# EasyEDA Pro project 21届智能车+蚂蚁搬家+主驱一体PCB文件.epro, board PCB8
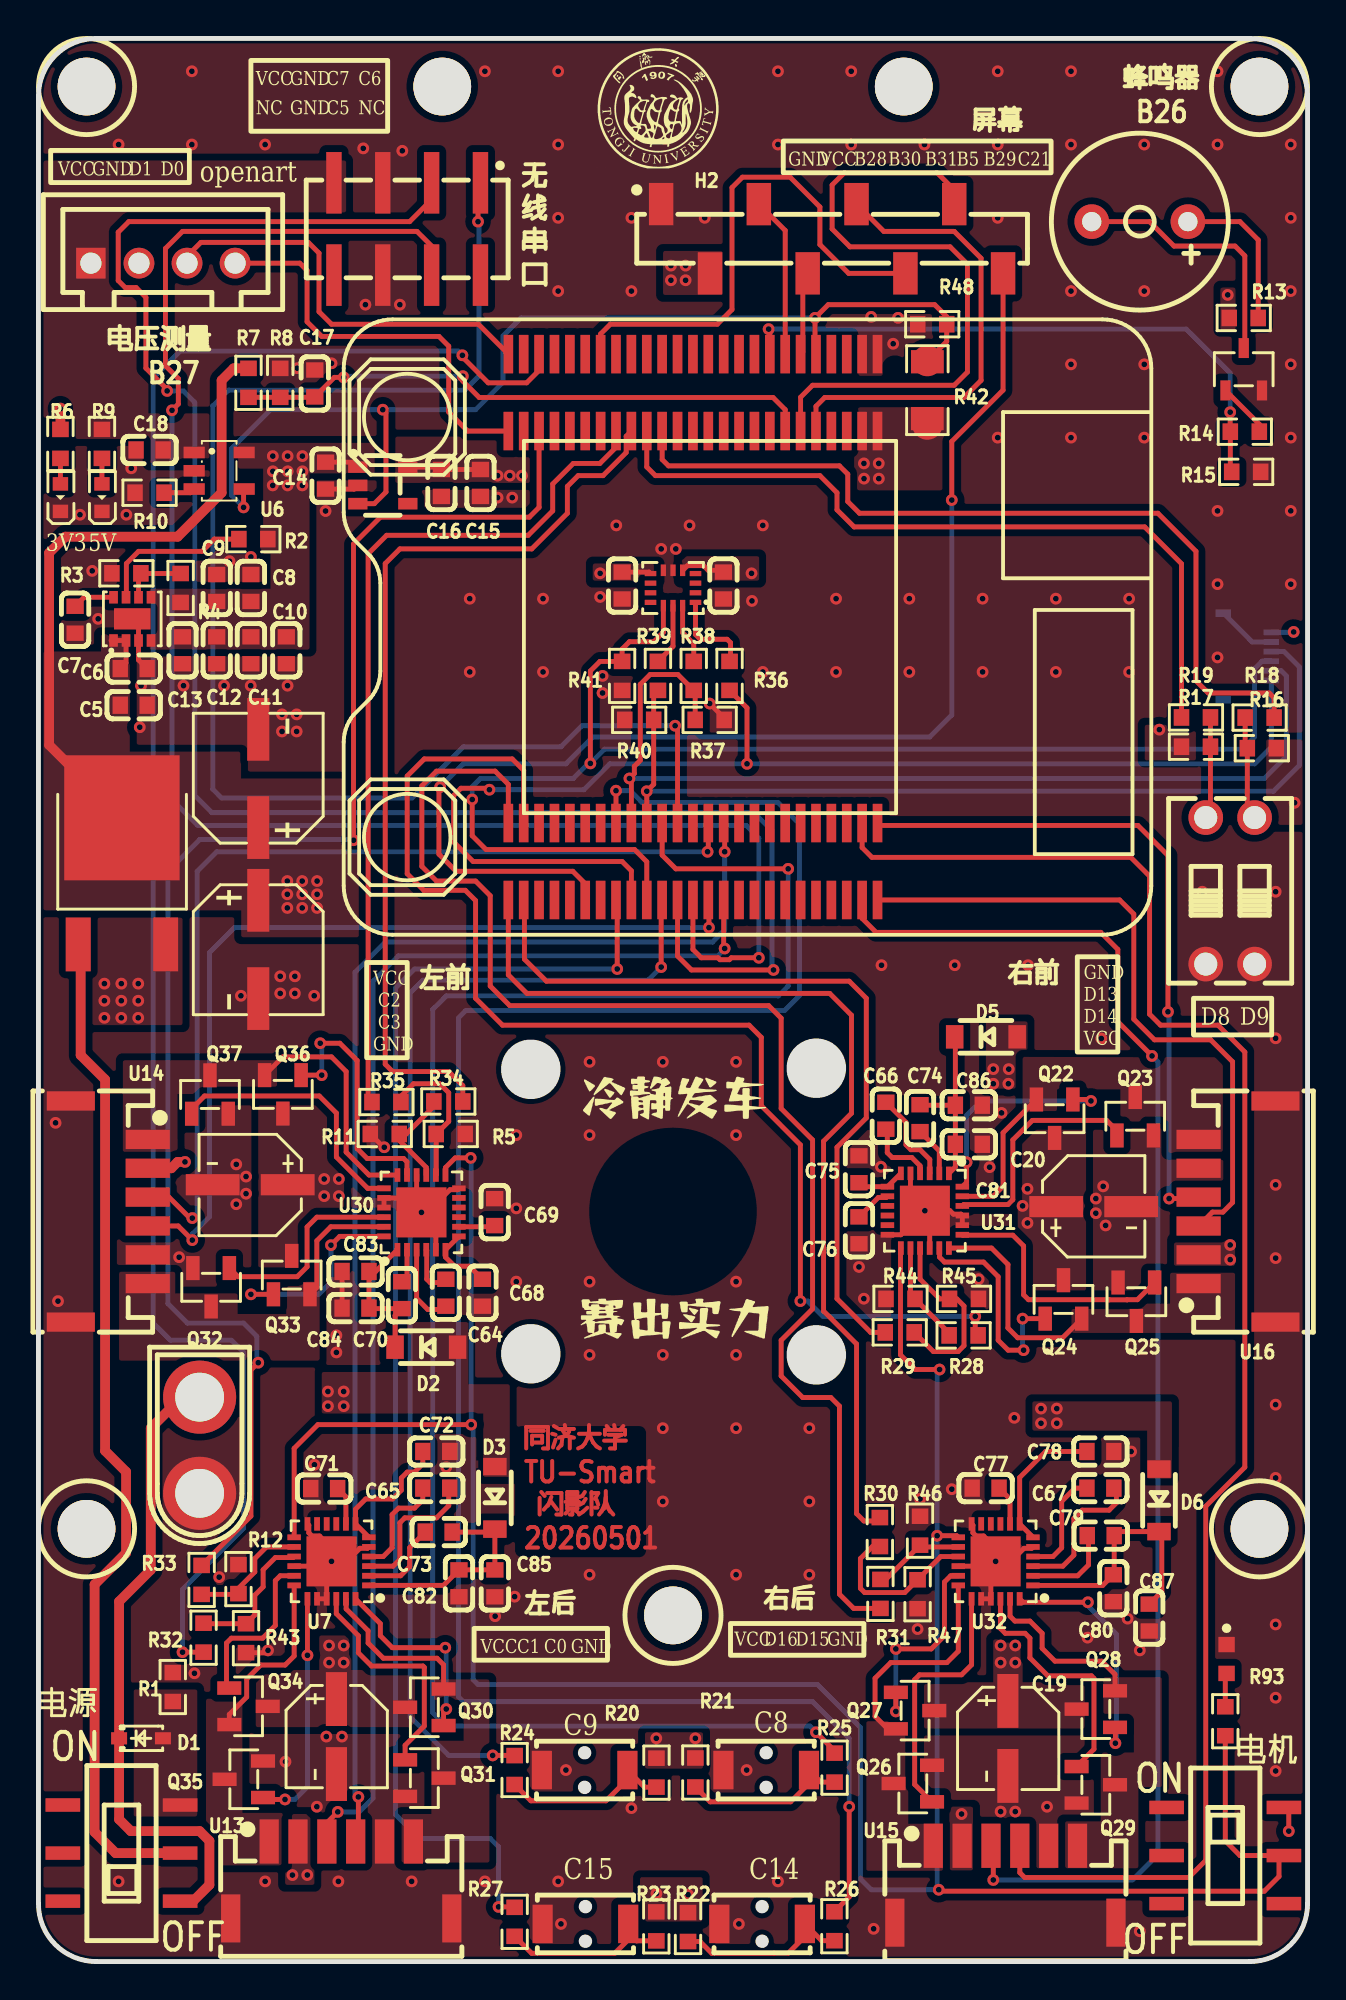
[diagram p39: board, top side]
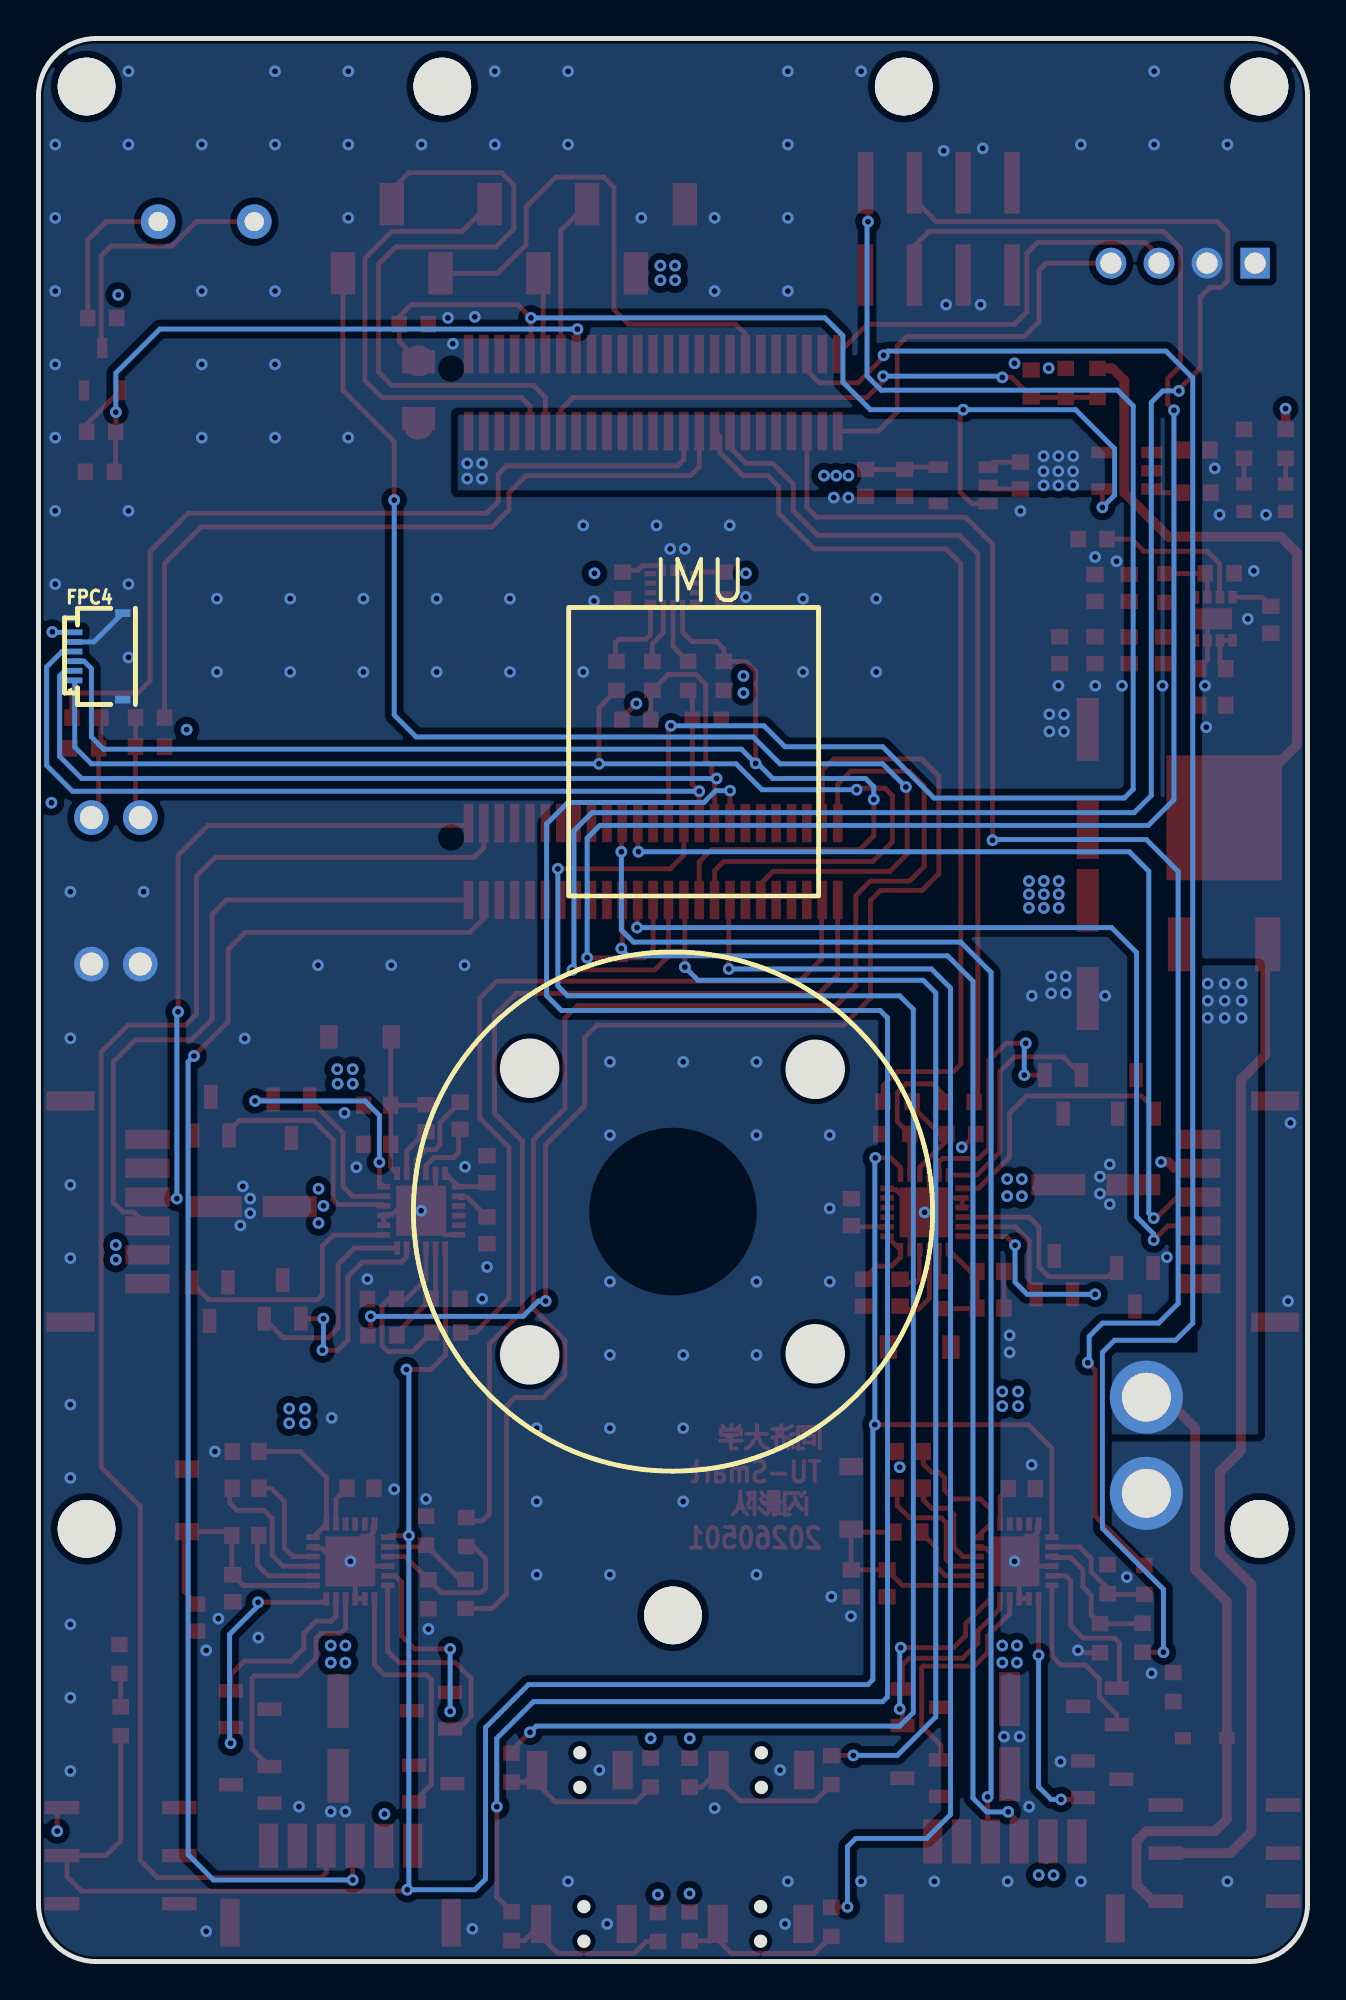
[diagram p40: board, bottom side, seen from below]

Outline 66 x 100 mm; copper layers: Top Layer, GND, POWER, Bottom Layer. Coordinates in mm from the lower left corner of the outline.
Outline path: 0,97 0,3 arc(0.88,0.88) 3,0 63,0 arc(65.12,0.88) 66,3 66,97 arc(65.12,99.12) 63,100 3,100 arc(0.88,99.12) 0,97
Stack: Top Layer 0.035mm 外层铜厚1oz / Dielectric1 0.2104mm 7628 RC49% 8.6mil / GND 0.0152mm 内层铜厚 / Dielectric2 1.065mm 1.1mm H/HOZ Copper / POWER 0.0152mm 内层铜厚 / Dielectric3 0.2104mm 7628 RC49% 8.6mil / Bottom Layer 0.035mm 外层铜厚1oz

## Design rules (mm)
spacing copperThickness1oz (default): track to track 0.152, other pairs 0.152 to 0.356
spacing copperThickness2oz: track to track 0.203, other pairs 0.152 to 0.3
spacing Plane_innerPlane: track to track 0.152, other pairs 0.152 to 0.356
spacing Copper_copperRegion: track to track 0.152, other pairs 0.152 to 0.356
spacing Copper_copperRegion1: track to track 0.152, other pairs 0.152 to 0.356
track width copperThickness1oz (default): min 0.127, default 0.254, max 2.54
track width copperThickness2oz: min 0.203, default 0.254, max 2.54
differential pair differentialPair (default): width min 0.127, default 0.254, max 2.54; gap min 0.152, default 0.152
net VCCBAT uses copperRegion1_copperThickness1oz
net GND uses copperRegion1_copperThickness1oz
net VCC5V uses copperRegion1_copperThickness1oz
net VCC3V3 uses copperRegion1_copperThickness1oz
net VCC5V_EXT uses copperRegion1_copperThickness1oz
net $2N1832 uses copperRegion1_copperThickness1oz
net $2N1855 uses copperRegion1_copperThickness1oz
net $2N1854 uses copperRegion1_copperThickness1oz
net $3N2832 uses copperRegion1_copperThickness1oz
net L_F_B uses copperRegion1_copperThickness1oz
net L_F_A uses copperRegion1_copperThickness1oz
net L_B_B uses copperRegion1_copperThickness1oz
net L_B_A uses copperRegion1_copperThickness1oz
net R_B_B uses copperRegion1_copperThickness1oz
net R_B_A uses copperRegion1_copperThickness1oz
net R_F_B uses copperRegion1_copperThickness1oz
net R_F_A uses copperRegion1_copperThickness1oz
net $4N1749 uses copperRegion1_copperThickness1oz
net $4N1772 uses copperRegion1_copperThickness1oz
net $4N1746 uses copperRegion1_copperThickness1oz
net $4N1698 uses copperRegion1_copperThickness1oz
pour e635 uses Copper_copperRegion1, copperRegion1_Copper_copperRegion1
pour e642 uses Copper_copperRegion1, copperRegion1_Copper_copperRegion1
pour e645 uses Copper_copperRegion1, copperRegion1_Copper_copperRegion1
pour e647 uses Copper_copperRegion1, copperRegion1_Copper_copperRegion1
pour e649 uses Copper_copperRegion1, copperRegion1_Copper_copperRegion1
pour e653 uses Copper_copperRegion1, copperRegion1_Copper_copperRegion1
pour e673 uses Copper_copperRegion1, copperRegion1_Copper_copperRegion1
pour e684 uses Copper_copperRegion1, copperRegion1_Copper_copperRegion1
pour e739 uses Copper_copperRegion1, copperRegion1_Copper_copperRegion1
pour e741 uses Copper_copperRegion1, copperRegion1_Copper_copperRegion1
pour e747 uses Copper_copperRegion1, copperRegion1_Copper_copperRegion1
pour e754 uses Copper_copperRegion1, copperRegion1_Copper_copperRegion1
pour e781 uses Copper_copperRegion1, copperRegion1_Copper_copperRegion1
pour e795 uses Copper_copperRegion1, copperRegion1_Copper_copperRegion1
pour e799 uses Copper_copperRegion1, copperRegion1_Copper_copperRegion1
pour e943 uses Copper_copperRegion1, copperRegion1_Copper_copperRegion1
pour e1277 uses Copper_copperRegion1, copperRegion1_Copper_copperRegion1
pour e1374 uses Copper_copperRegion1, copperRegion1_Copper_copperRegion1
pour e1376 uses Copper_copperRegion1, copperRegion1_Copper_copperRegion1
pour e1449 uses Copper_copperRegion1, copperRegion1_Copper_copperRegion1
pour e1453 uses Copper_copperRegion1, copperRegion1_Copper_copperRegion1
pour e1477 uses Copper_copperRegion1, copperRegion1_Copper_copperRegion1
pour e1490 uses Copper_copperRegion1, copperRegion1_Copper_copperRegion1
pour e1492 uses Copper_copperRegion1, copperRegion1_Copper_copperRegion1
pour e1494 uses Copper_copperRegion1, copperRegion1_Copper_copperRegion1
pour e1503 uses Copper_copperRegion1, copperRegion1_Copper_copperRegion1
pour e1515 uses Copper_copperRegion1, copperRegion1_Copper_copperRegion1
pour e1519 uses Copper_copperRegion1, copperRegion1_Copper_copperRegion1
pour e1553 uses Copper_copperRegion1, copperRegion1_Copper_copperRegion1
pour e1556 uses Copper_copperRegion1, copperRegion1_Copper_copperRegion1
pour e1560 uses Copper_copperRegion1, copperRegion1_Copper_copperRegion1
pour e1564 uses Copper_copperRegion1, copperRegion1_Copper_copperRegion1
pour e1570 uses Copper_copperRegion1, copperRegion1_Copper_copperRegion1
pour e1580 uses Copper_copperRegion1, copperRegion1_Copper_copperRegion1
pour e1582 uses Copper_copperRegion1, copperRegion1_Copper_copperRegion1
pour e1585 uses Copper_copperRegion1, copperRegion1_Copper_copperRegion1
pour e1608 uses Copper_copperRegion1, copperRegion1_Copper_copperRegion1
pour e1617 uses Copper_copperRegion1, copperRegion1_Copper_copperRegion1
pour e1622 uses Copper_copperRegion1, copperRegion1_Copper_copperRegion1
pour e1624 uses Copper_copperRegion1, copperRegion1_Copper_copperRegion1
pour e1837 uses Copper_copperRegion1, copperRegion1_Copper_copperRegion1
pour e2029 uses Copper_copperRegion1, copperRegion1_Copper_copperRegion1
pour e2083 uses Copper_copperRegion1, copperRegion1_Copper_copperRegion1

## Placement (name value [footprint] x y rotation side)
BUZZER1  3kHz  [BUZ-TH_BD9.0-P5.00-D0.6-FD]  57.28 90.47 180 top
C1  220uF  [CAP-SMD_BD6.3-L6.6-W6.6-LS7.2-R-RD]  11.43 52.63 90 top
C2  220uF  [CAP-SMD_BD6.3-L6.6-W6.6-LS7.2-R-RD]  11.43 61.52 270 top
C3  47uF  [CAP-SMD_BD5.0-L5.3-W5.3-LS5.9-FD]  15.5 11.7 270 top
C4  47uF  [CAP-SMD_BD5.0-L5.3-W5.3-LS5.9-FD]  11.01 40.39 180 top
C5  10uF  [C0603]  4.95 65.33 180 top
C6  100nF  [C0603]  4.95 67.23 180 top
C7  430pF  [C0603]  1.91 69.77 270 top
C8  22uF  [C0603]  11.05 71.42 90 top
C9  22uF  [C0603]  9.27 71.42 90 top
C10  22uF  [C0603]  12.89 68.19 270 top
C11  22uF  [C0603]  11.05 68.19 270 top
C12  10uF  [C0603]  9.27 68.19 270 top
C13  100nF  [C0603]  7.49 68.19 270 top
C14  100nF  [C0603]  14.93 77.27 90 top
C15  10uF  [C0603]  22.99 76.89 90 top
C16  100nF  [C0603]  20.96 76.89 90 top
C17  100nF  [C0603]  14.37 82.06 270 top
C18  100nF  [C0603]  5.78 78.6 0 top
C19  47uF  [CAP-SMD_BD5.0-L5.3-W5.3-LS5.9-FD]  50.42 11.6 270 top
C20  47uF  [CAP-SMD_BD5.0-L5.3-W5.3-LS5.9-FD]  54.88 39.26 0 top
C27  100nF  [C0603]  35.62 71.55 270 top
C28  100nF  [C0603]  30.35 71.55 270 top
C64  100nF  [C0603]  21.19 34.78 90 top
C65  100nF  [C0603]  20.69 24.62 180 top
C66  100nF  [C0603]  44.07 43.98 270 top
C67  100nF  [C0603]  55.23 24.62 180 top
C68  1uF  [C0603]  23.09 34.78 90 top
C69  1uF  [C0603]  23.73 38.97 270 top
C70  1uF  [C0603]  18.9 34.65 270 top
C71  1uF  [C0603]  14.86 24.59 0 top
C72  1uF  [C0603]  20.69 26.52 180 top
C73  1uF  [C0603]  20.81 22.33 0 top
C74  1uF  [C0603]  45.85 43.86 90 top
C75  1uF  [C0603]  42.67 41.2 270 top
C76  1uF  [C0603]  42.67 38.02 90 top
C77  1uF  [C0603]  49.26 24.62 0 top
C78  1uF  [C0603]  55.23 26.52 180 top
C79  1uF  [C0603]  55.25 22.15 0 top
C80  100nF  [C0603]  55.9 19.41 90 top
C81  100nF  [C0603]  48.38 42.5 180 top
C82  100nF  [C0603]  21.87 19.67 90 top
C83  100nF  [C0603]  16.49 35.88 0 top
C84  10uF  [C0603]  16.49 33.98 180 top
C85  10uF  [C0603]  23.74 19.66 270 top
C86  10uF  [C0603]  48.38 44.53 0 top
C87  10uF  [C0603]  57.77 17.89 270 top
CN2  ZX-XH2.54-4PZZ  [CONN-TH_4P-P2.50_4PIN]  6.48 88.32 0 top
CN4  PM254-2-04-S-8.5  [HDR-SMD_8P-P2.54-V-F-R2-C4-S7.1]  19.18 90.09 180 top
CN10  XT30U-M  [CONN-TH_XT30U-M]  8.38 26.85 270 top
D1  BZT52C16S  [SOD-323_L1.7-W1.3-LS2.6-RD]  5.33 11.61 0 top
D2  1N5819W  [SOD-123_L2.7-W1.6-LS3.7-R-RD]  20.17 31.95 0 top
D3  1N5819W  [SOD-123_L2.7-W1.6-LS3.7-R-RD]  23.74 24.11 90 top
D5  1N5819W  [SOD-123_L2.7-W1.6-LS3.7-R-RD]  49.27 48.08 0 top
D6  1N5819W  [SOD-123_L2.7-W1.6-LS3.7-R-RD]  58.27 23.98 90 top
FH2  智能车逐飞摄像头固定孔  [智能车逐飞摄像头支架固定孔]  33 39 270 bottom
FPC4  HC-FPC-05-09-6RLTAG  [FPC-SMD_6P-P0.50_HC-FPC-05-09-6RLTAG]  62.87 67.87 270 bottom
H2  HX PM2.54-1x8P TP-YQ  [HDR-SMD_8P-P2.54-V-F-LS4.9]  41.28 89.59 0 top
LED1  Blue  [LEDC1608(0603)]  61.79 15.73 270 top
NOREF  -  [Pad_e2]  2.5 22.5 0 top
NOREF#2  -  [Pad_e1229]  46.23 83.24 0 top
NOREF#3  -  [Pad_e1230]  46.23 79.93 0 top
NOREF#4  -  [Pad_e749]  33 18 0 top
NOREF#5  -  [Pad_e628]  45 97.5 0 top
NOREF#6  -  [Pad_e1]  63.5 22.5 0 top
NOREF#7  -  [Pad_e3]  2.5 97.5 0 top
NOREF#8  -  [Pad_e626]  21 97.5 0 top
NOREF#9  -  [Pad_e4]  63.5 97.5 0 top
Q1  HY19P03D  [TO-252-2_L6.6-W6.1-P4.57-LS9.9-TL-CW]  4.34 56.18 90 top
Q2  S8050 J3Y(RANGE:200-350)  [SOT-23-3_L3.0-W1.7-P0.95-LS2.9-BR]  62.68 82.8 270 top
Q22  AO3400A  [SOT-23-3_L2.9-W1.3-P1.90-LS2.4-BR]  52.85 43.83 90 top
Q23  AO3400A  [SOT-23-3_L2.9-W1.3-P1.90-LS2.4-BR]  57.04 43.95 270 top
Q24  AO3400A  [SOT-23-3_L2.9-W1.3-P1.90-LS2.4-BR]  53.31 34.43 270 top
Q25  AO3400A  [SOT-23-3_L2.9-W1.3-P1.90-LS2.4-BR]  57.1 34.31 90 top
Q26  AO3400A  [SOT-23-3_L2.9-W1.3-P1.90-LS2.4-BR]  45.47 9.26 0 top
Q27  AO3400A  [SOT-23-3_L2.9-W1.3-P1.90-LS2.4-BR]  45.59 13.05 180 top
Q28  AO3400A  [SOT-23-3_L2.9-W1.3-P1.90-LS2.4-BR]  54.99 13.13 0 top
Q29  AO3400A  [SOT-23-3_L2.9-W1.3-P1.90-LS2.4-BR]  54.99 9.19 180 top
Q30  AO3400A  [SOT-23-3_L2.9-W1.3-P1.90-LS2.4-BR]  20.07 13.22 0 top
Q31  AO3400A  [SOT-23-3_L2.9-W1.3-P1.90-LS2.4-BR]  20.07 9.54 180 top
Q32  AO3400A  [SOT-23-3_L2.9-W1.3-P1.90-LS2.4-BR]  8.98 35.06 90 top
Q33  AO3400A  [SOT-23-3_L2.9-W1.3-P1.90-LS2.4-BR]  13.17 35.7 270 top
Q34  AO3400A  [SOT-23-3_L2.9-W1.3-P1.90-LS2.4-BR]  10.92 13.27 180 top
Q35  AO3400A  [SOT-23-3_L2.9-W1.3-P1.90-LS2.4-BR]  10.68 9.48 0 top
Q36  AO3400A  [SOT-23-3_L2.9-W1.3-P1.90-LS2.4-BR]  12.71 45.09 90 top
Q37  AO3400A  [SOT-23-3_L2.9-W1.3-P1.90-LS2.4-BR]  8.92 45.08 270 top
R1  10kΩ  [R0603]  6.98 14.28 270 top
R2  100kΩ  [R0603]  11.18 73.97 180 top
R3  100kΩ  [R0603]  4.57 72.19 180 top
R4  523kΩ  [R0603]  7.39 71.42 270 top
R5  10kΩ  [R0603]  21.44 43.03 180 top
R6  4.7kΩ  [R0603]  1.14 78.92 270 top
R7  10kΩ  [R0603]  10.92 82.09 270 top
R8  1kΩ  [R0603]  12.57 82.09 90 top
R9  10kΩ  [R0603]  3.3 78.92 90 top
R10  4.7kΩ  [R0603]  5.78 76.38 0 top
R11  10kΩ  [R0603]  18.01 43.03 0 top
R12  10kΩ  [R0603]  10.4 19.89 270 top
R13  10Ω  [R0603]  62.68 85.47 0 top
R14  4.7kΩ  [R0603]  62.74 79.55 180 top
R15  1kΩ  [R0603]  62.81 77.46 0 top
R16  4.7kΩ  [R0603]  63.62 63.09 0 top
R17  4.7kΩ  [R0603]  60.2 63.17 180 top
R18  100Ω  [R0603]  63.51 64.69 0 top
R19  100Ω  [R0603]  60.2 64.69 180 top
R20  4.7kΩ  [R0603]  32.14 9.82 90 top
R21  4.7kΩ  [R0603]  34.16 9.83 90 top
R22  4.7kΩ  [R0603]  33.78 1.79 90 top
R23  4.7kΩ  [R0603]  32.13 1.83 90 top
R24  100Ω  [R0603]  24.76 9.96 90 top
R25  100Ω  [R0603]  41.4 10.08 90 top
R26  100Ω  [R0603]  41.39 1.84 90 top
R27  100Ω  [R0603]  24.76 2.07 90 top
R28  100Ω  [R0603]  48.11 32.56 180 top
R29  100Ω  [R0603]  44.79 32.72 180 top
R30  100Ω  [R0603]  43.76 22.33 270 top
R31  100Ω  [R0603]  43.79 19.12 270 top
R32  100Ω  [R0603]  8.59 16.84 90 top
R33  100Ω  [R0603]  8.49 19.85 90 top
R34  100Ω  [R0603]  21.32 44.72 180 top
R35  100Ω  [R0603]  18.1 44.69 180 top
R36  220Ω  [R0603]  35.94 66.85 90 top
R37  10kΩ  [R0603]  34.91 64.57 180 top
R38  220Ω  [R0603]  34.08 66.85 270 top
R39  220Ω  [R0603]  32.22 66.85 270 top
R40  10kΩ  [R0603]  31.24 64.57 0 top
R41  10kΩ  [R0603]  30.35 66.85 90 top
R42  0Ω  [R1206]  46.23 81.71 270 top
R43  10kΩ  [R0603]  10.79 16.81 90 top
R44  10kΩ  [R0603]  44.83 34.46 0 top
R45  10kΩ  [R0603]  48.13 34.46 180 top
R46  10kΩ  [R0603]  45.85 22.4 270 top
R47  10kΩ  [R0603]  45.72 19.1 90 top
R48  10kΩ  [R0603]  46.48 85.14 180 top
R93  330Ω  [R0603]  61.72 12.5 90 top
SW3  DSWB02LHGET  [SW-TH_DSWB02LHGET]  61.98 55.68 0 top
U1  RT9013-33GB  [SOT-23-5_L3.0-W1.7-P0.95-LS2.8-BR#2]  17.91 76.76 180 top
U2  42-51/GHC-YW2X2K/3T  [LED-SMD_L1.6-W0.8-FD_GREEN-1]  1.14 76.12 270 top
U3  RT1021_BTB_CoreBoard  [RT1021_BTB_COREBOARD]  34.04 69.39 0 top
U4  42-51/GHC-YW2X2K/3T  [LED-SMD_L1.6-W0.8-FD_GREEN-1]  3.3 76.12 270 top
U5  SS-3235S-L1  [SW-SMD_SS-3235S-LX]  61.72 5.51 90 top
U6  SY6280AAC  [SOT-23-5_L3.0-W1.7-P0.95-LS2.8-BR]  9.4 77.52 180 top
U7  DRV8701E  [VQFN-24_L4.0-W4.0-P0.50-BL-EP2.5]  15.24 20.81 90 top
U8  ZX-QC34-2TPDZ  [KEY-SMD_L3.9-W3.0-LS5.0-EH]  28.4 9.96 180 top
U9  ZX-QC34-2TPDZ  [KEY-SMD_L3.9-W3.0-LS5.0-EH]  37.85 9.96 180 top
U10  ZX-QC34-2TPDZ  [KEY-SMD_L3.9-W3.0-LS5.0-EH]  37.63 1.96 180 top
U11  ZX-QC34-2TPDZ  [KEY-SMD_L3.9-W3.0-LS5.0-EH]  28.45 1.96 180 top
U12  TPS82130SILR  [USIP-8_L3.0-W2.8-P0.65-TL-EP]  4.88 69.82 90 top
U13  ZX-ZH1.5-6PWT  [CONN-SMD_6P-P1.50_ZX-ZH1.5-6PWT]  15.75 4.24 0 top
U14  ZX-ZH1.5-6PWT  [CONN-SMD_6P-P1.50_ZX-ZH1.5-6PWT]  3.68 39 270 top
U15  ZX-ZH1.5-6PWT  [CONN-SMD_6P-P1.50_ZX-ZH1.5-6PWT]  50.29 4.02 0 top
U16  ZX-ZH1.5-6PWT  [CONN-SMD_6P-P1.50_ZX-ZH1.5-6PWT]  62.33 39 90 top
U30  DRV8701E  [VQFN-24_L4.0-W4.0-P0.50-BL-EP2.5]  19.92 38.96 0 top
U31  DRV8701E  [VQFN-24_L4.0-W4.0-P0.50-BL-EP2.5]  46.1 39.04 180 top
U32  DRV8701E  [VQFN-24_L4.0-W4.0-P0.50-BL-EP2.5]  49.78 20.81 90 top
U41  SS-3235S-L1  [SW-SMD_SS-3235S-LX]  4.32 5.64 270 top
U42  LSM6DSRTR  [LGA-14_L3.0-W2.5-P0.50-BR]  33 71.42 0 top

## Footprints (pads in the part's own frame, mm; a bottom-side part is the same pattern mirrored in y, then rotated)
BUZ-TH_BD9.0-P5.00-D0.6-FD
  round 1.8 hole 1: 1(-2.5,0) 2(2.5,0)
C0603
  rect 0.8x0.9 smd: 1(-0.7,0) 2(0.7,0)
CAP-SMD_BD5.0-L5.3-W5.3-LS5.9-FD
  rect 2.8x1.1 smd: 1(-1.95,0) 2(1.95,0)
CAP-SMD_BD6.3-L6.6-W6.6-LS7.2-R-RD
  rect 3.26x1.15 smd: 1(2.555,0) 2(-2.555,0)
CONN-SMD_6P-P1.50_ZX-ZH1.5-6PWT
  rect 1x2.3 smd: 1(-3.75,2) 2(-2.25,2) 3(-0.75,2) 4(0.75,2) 5(2.25,2) 6(3.75,2)
  rect 1x2.5 smd: 7(5.75,-2) 8(-5.75,-2)
CONN-TH_4P-P2.50_4PIN
  rect 1.524x1.6 hole 1.1: 1(-3.75,0)
  round 1.6 hole 1.1: 2(-1.25,0) 3(1.25,0) 4(3.75,0)
CONN-TH_XT30U-M
  round 3.8 hole 2.54: 1(-2.5,0) 2(2.5,0)
FPC-SMD_6P-P0.50_HC-FPC-05-09-6RLTAG
  rect 0.3x0.8 smd: 1(1.25,-1.25) 2(0.75,-1.25) 3(0.25,-1.25) 4(-0.25,-1.25) 5(-0.75,-1.25) 6(-1.25,-1.25)
  rect 0.4x0.8 smd: 7(-2.25,1.25) 8(2.25,1.25)
HDR-SMD_8P-P2.54-V-F-LS4.9
  rect 1.27x2.2 smd: 1(-8.89,1.8) 2(-6.35,-1.8) 3(-3.81,1.8) 4(-1.27,-1.8) 5(1.27,1.8) 6(3.81,-1.8) 7(6.35,1.8) 8(8.89,-1.8)
HDR-SMD_8P-P2.54-V-F-R2-C4-S7.1
  rect 0.8x3.2 smd: 1(-3.81,-2.4) 2(-3.81,2.4) 3(-1.27,-2.4) 4(-1.27,2.4) 5(1.27,-2.4) 6(1.27,2.4) 7(3.81,-2.4) 8(3.81,2.4)
KEY-SMD_L3.9-W3.0-LS5.0-EH
  rect 1.05x2 smd: 1(-2.225,0) 2(2.225,0)
LED-SMD_L1.6-W0.8-FD_GREEN-1
  rect 0.7x0.8 smd: 1(-0.715,0) 2(0.715,0)
LEDC1608(0603)
  rect 0.8x0.85 smd: A(0.75,0) C(-0.75,0)
LGA-14_L3.0-W2.5-P0.50-BR
  rect 0.6x0.27 smd: 1(1.17,-0.75) 2(1.17,-0.25) 3(1.17,0.25) 4(1.17,0.75) 8(-1.17,0.75) 9(-1.17,0.25) 10(-1.17,-0.25) 11(-1.17,-0.75)
  rect 0.27x0.6 smd: 5(0.5,0.92) 6(0,0.92) 7(-0.5,0.92) 12(-0.5,-0.92) 13(0,-0.92) 14(0.5,-0.92)
Pad_e1
  round 3 hole 3: 1(0,0)
Pad_e2
  round 3 hole 3: 1(0,0)
Pad_e3
  round 3 hole 3: 1(0,0)
Pad_e4
  round 3 hole 3: 1(0,0)
Pad_e626
  round 3 hole 3: 1(0,0)
Pad_e628
  round 3 hole 3: 1(0,0)
Pad_e749
  round 3 hole 3: 1(0,0)
Pad_e1229
  round 1.6 smd: 1(0,0)
Pad_e1230
  round 1.6 smd: 1(0,0)
R0603
  rect 0.806x0.864 smd: 1(-0.753,0) 2(0.753,0)
R1206
  rect 1.208x1.701 smd: 1(-1.479,0) 2(1.479,0)
RT1021_BTB_COREBOARD
  round 0 hole 0.65: 0(-10.5,13.442) 0(-10.5,-10.942) 0(10.5,13.442) 0(10.5,-10.942)
  rect 0.5x2 smd: A1(9.6,14.192) A2(9.6,10.192) A3(8.8,14.192) A4(8.8,10.192) A5(8,14.192) A6(8,10.192) A7(7.2,14.192) A8(7.2,10.192) A9(6.4,14.192) A10(6.4,10.192) A11(5.6,14.192) A12(5.6,10.192) A13(4.8,14.192) A14(4.8,10.192) A15(4,14.192) A16(4,10.192) A17(3.2,14.192) A18(3.2,10.192) A19(2.4,14.192) A20(2.4,10.192) A21(1.6,14.192) A22(1.6,10.192) A23(0.8,14.192) A24(0.8,10.192) A25(0,14.192) A26(0,10.192) A27(-0.8,14.192) A28(-0.8,10.192) A29(-1.6,14.192) A30(-1.6,10.192) A31(-2.4,14.192) A32(-2.4,10.192) A33(-3.2,14.192) A34(-3.2,10.192) A35(-4,14.192) A36(-4,10.192) A37(-4.8,14.192) A38(-4.8,10.192) A39(-5.6,14.192) A40(-5.6,10.192) A41(-6.4,14.192) A42(-6.4,10.192) A43(-7.2,14.192) A44(-7.2,10.192) A45(-8,14.192) A46(-8,10.192) A47(-8.8,14.192) A48(-8.8,10.192) A49(-9.6,14.192) A50(-9.6,10.192) B1(9.6,-10.192) B2(9.6,-14.192) B3(8.8,-10.192) B4(8.8,-14.192) B5(8,-10.192) B6(8,-14.192) B7(7.2,-10.192) B8(7.2,-14.192) B9(6.4,-10.192) B10(6.4,-14.192) B11(5.6,-10.192) B12(5.6,-14.192) B13(4.8,-10.192) B14(4.8,-14.192) B15(4,-10.192) B16(4,-14.192) B17(3.2,-10.192) B18(3.2,-14.192) B19(2.4,-10.192) B20(2.4,-14.192) B21(1.6,-10.192) B22(1.6,-14.192) B23(0.8,-10.192) B24(0.8,-14.192) B25(0,-10.192) B26(0,-14.192) B27(-0.8,-10.192) B28(-0.8,-14.192) B29(-1.6,-10.192) B30(-1.6,-14.192) B31(-2.4,-10.192) B32(-2.4,-14.192) B33(-3.2,-10.192) B34(-3.2,-14.192) B35(-4,-10.192) B36(-4,-14.192) B37(-4.8,-10.192) B38(-4.8,-14.192) B39(-5.6,-10.192) B40(-5.6,-14.192) B41(-6.4,-10.192) B42(-6.4,-14.192) B43(-7.2,-10.192) B44(-7.2,-14.192) B45(-8,-10.192) B46(-8,-14.192) B47(-8.8,-10.192) B48(-8.8,-14.192) B49(-9.6,-10.192) B50(-9.6,-14.192)
SOD-123_L2.7-W1.6-LS3.7-R-RD
  rect 0.909x1.219 smd: 1(1.625,0) 2(-1.625,0)
SOD-323_L1.7-W1.3-LS2.6-RD
  rect 0.83x0.63 smd: 1(-1.14,0) 2(1.14,0)
SOT-23-3_L2.9-W1.3-P1.90-LS2.4-BR
  rect 1.25x0.7 smd: 1(1,-0.95) 2(1,0.95) 3(-1,0)
SOT-23-3_L3.0-W1.7-P0.95-LS2.9-BR
  rect 1.038x0.532 smd: 1(1.101,-0.95) 2(1.101,0.95) 3(-1.101,0)
SOT-23-5_L3.0-W1.7-P0.95-LS2.8-BR
  rect 1.1x0.6 smd: 1(1.3,-0.95) 2(1.3,0) 3(1.3,0.95) 4(-1.3,0.95) 5(-1.3,-0.95)
SOT-23-5_L3.0-W1.7-P0.95-LS2.8-BR#2
  rect 1x0.6 smd: 1(1.3,-0.95) 2(1.3,0) 3(1.3,0.95) 4(-1.3,0.95) 5(-1.3,-0.95)
SW-SMD_SS-3235S-LX
  rect 0.7x1.8 smd: 1(-2.5,3.05) 2(0,3.05) 3(2.5,3.05) 4(-2.5,-3.05) 5(0,-3.05) 6(2.5,-3.05)
SW-TH_DSWB02LHGET
  round 1.8 hole 1.2: 1(-1.27,3.81) 2(1.27,3.81) 3(-1.27,-3.81) 4(1.27,-3.81)
TO-252-2_L6.6-W6.1-P4.57-LS9.9-TL-CW
  rect 2.8x1.3 smd: 1(-3.292,2.273) 3(-3.292,-2.273)
  rect 6.5x6 smd: 2(3.292,0)
USIP-8_L3.0-W2.8-P0.65-TL-EP
  rect 0.65x0.45 smd: 1(-1.125,0.975) 2(-1.125,0.325) 3(-1.125,-0.325) 4(-1.125,-0.975) 5(1.125,-0.975) 6(1.125,-0.325) 7(1.125,0.325) 8(1.125,0.975)
  rect 1.1x1.9 smd: 9(0,0)
VQFN-24_L4.0-W4.0-P0.50-BL-EP2.5
  rect 0.3x0.7 smd: 1(-1.25,-1.942) 2(-0.75,-1.942) 3(-0.25,-1.942) 4(0.25,-1.942) 5(0.75,-1.942) 6(1.25,-1.942) 13(1.25,1.942) 14(0.75,1.942) 15(0.25,1.942) 16(-0.25,1.942) 17(-0.75,1.942) 18(-1.25,1.942)
  rect 0.7x0.3 smd: 7(1.948,-1.25) 8(1.948,-0.75) 9(1.948,-0.25) 10(1.948,0.25) 11(1.948,0.75) 12(1.948,1.25) 19(-1.948,1.25) 20(-1.948,0.75) 21(-1.948,0.25) 22(-1.948,-0.25) 23(-1.948,-0.75) 24(-1.948,-1.25)
  rect 2.6x2.6 smd: 25(0.001,-0.001)

## Nets
As in the schematic, except:
VCC5V: C8.1 C9.1 C10.1 C11.1 C12.1 C13.1 C14.2 NOREF#3.1 R2.1 R4.2 R42.2 U1.1 U3.A2 U3.A4 U6.5 U12.4 U12.5
CR: NOREF#2.1 R42.1 R48.1 U1.3 U3.A9 U6.4

Pads without a net: CN4 2 8; NOREF 1; NOREF#4 1; NOREF#5 1; NOREF#6 1; NOREF#7 1; NOREF#8 1; NOREF#9 1; U1 4; U3 0 A5 A6 A7 A8 A16 A17 A18 A19 A20 A21 A22 A23 A24 A25 A26 A27 A28 A29 A31 A33 A35 A38 A39 A40 A41 A42 A43 A44 A47 A48 B5 B6 B7 B8 B9 B10 B11 B12 B13 B14 B15 B16 B17 B18 B19 B20 B25 B37 B38 B39 B41 B42 B43 B44 B45 B46; U5 1 2 3 4; U7 9 10 11; U30 9 10 11; U31 9 10 11; U32 9 10 11; U41 4 5 6; U42 2 3 4 9 10 11

## Via types
v1: diameter 0.61, hole 0.305, Top Layer to Bottom Layer, 348 vias

## Routing (per net, layer and track width the routed paths; a pad name or vN(x,y) marks a point on that pad's centre or on a via; arc(x,y) is an arc through that point)
GND: length 48.6
  Top Layer w0.254: U31.20 U31.21 47.98,38.86 47.58,38.86 47.4,39.04 v1(46.1,39.04) ; v1(15.24,20.81) 15.24,21.51 14.62,22.13 14.22,22.13 14.06,22.29 14.06,22.69 U7.12 ; v1(15.24,20.81) 16.04,20.81 16.72,21.49 17.11,21.49 17.18,21.56 ; v1(15.24,20.81) 14.99,20.56 ; 49.53,20.56 U32.21 U32.20 ; 49.53,20.56 U32.16 ; 49.53,20.56 v1(49.78,20.81) ; U32.12 48.6,22.69 48.6,22.29 48.76,22.13 49.16,22.13 49.78,21.51 v1(49.78,20.81) ; R43.1 11.82,16.06 v1(11.94,16.18) ; v1(46.1,39.04) 44.85,37.79 U31.12 ; v1(46.1,39.04) 45.35,39.79 U31.5 ; v1(46.1,39.04) 46.35,38.79 U31.16 ; U32.5 51.65,21.49 51.25,21.49 50.58,20.81 v1(49.78,20.81) ; U30.5 20.67,38.21 v1(19.92,38.96) 20.57,38.96 20.83,39.21 20.83,39.56 21.4,40.14 21.79,40.14 U30.12 ; C83.1 C84.2 ; 14.49,18.86 14.99,18.86 14.99,20.56 ; v1(17.98,42.34) 17.95,42.34 R11.1 ; 14.99,20.56 U7.16 ; 17.97,39.21 17.97,39.71 19.17,39.71 19.67,39.21 19.67,40.9 ; C6.1 5.2,67.68 5.2,69.49 U12.9 ; C14.1 16.41,76.57 U1.2
  Bottom Layer w0.254: FPC4.7 63.12,68.62 FPC4.5
  vias: v1(0.89,43.61) v1(1.02,34.34) v1(2.16,75.23) v1(2.79,72.31) v1(3.11,69.82) v1(4.17,94.48) v1(4.17,4.17) v1(4.57,75.23) v1(4.83,77.65) v1(5.33,66.34) v1(5.27,64.19) v1(7.31,36.63) v1(7.54,66.34) v1(7.98,98.29) v1(7.98,94.48) v1(8.11,14.99) v1(9.4,19.99) v1(9.65,66.34) v1(9.94,72.81) v1(10.29,41.45) v1(10.29,39.38) v1(10.53,50.22) v1(10.79,40.82) v1(10.79,39.93) v1(11.05,73.04) v1(11.04,66.34) v1(11.79,94.48) v1(11.79,4.17) v1(12.57,51.23) v1(12.57,50.34) v1(12.67,64.85) v1(12.67,63.96) v1(12.85,10.39) v1(12.95,66.34) v1(13.34,51.23) v1(13.34,50.34) v1(13.43,64.85) v1(13.43,63.96) v1(13.46,82.86) v1(14.34,50.22) v1(14.35,25.83) v1(14.48,8.05) v1(14.93,75.43) v1(14.97,11.7) v1(15.24,83.11) v1(15.49,32.56) v1(15.49,31.67) v1(15.6,4.17) v1(15.78,11.7) v1(16.89,94.28) v1(17,86.16) v1(18.8,86.16) v1(18.92,94.16) v1(19.41,4.17) v1(21.21,25.71) v1(22.43,70.87) v1(22.43,67.06) v1(23.22,98.29) v1(23.22,4.17) v1(23.75,17.96) v1(23.88,76.12) v1(24.64,76.12) v1(24.76,18.97) v1(24.85,42.97) v1(24.85,39.16) v1(24.85,35.35) v1(26.24,70.87) v1(26.24,67.06) v1(27.03,98.29) v1(27.03,94.48) v1(27.03,90.67) v1(27.03,86.86) v1(27.03,4.17) v1(27.17,1.96) v1(27.43,9.96) v1(28.66,46.78) v1(28.66,42.97) v1(28.66,35.35) v1(28.66,31.54) v1(28.66,20.11) v1(29.21,70.96) v1(30.05,74.68) v1(30.84,90.67) v1(30.84,86.86) v1(30.84,7.98) v1(32.38,73.46) v1(32.47,46.78) v1(32.47,31.54) v1(32.47,27.73) v1(32.47,23.92) v1(33.15,73.46) v1(33.86,74.68) v1(34.65,90.67) v1(36.28,46.78) v1(36.28,42.97) v1(36.28,35.35) v1(36.28,31.54) v1(36.28,27.73) v1(36.28,20.11) v1(36.43,1.96) v1(36.83,9.96) v1(37.11,70.75) v1(37.67,74.68) v1(37.67,67.06) v1(38.46,98.29) v1(38.46,94.48) v1(38.46,4.17) v1(40.09,27.73) v1(40.09,23.92) v1(40.09,20.11) v1(41.48,70.87) v1(41.48,67.06) v1(42.27,98.29) v1(42.27,94.48) v1(42.67,36.12) v1(42.93,34.47) v1(43.31,85.52) v1(43.43,1.7) v1(43.84,51.81) v1(43.81,41.33) v1(44.45,84.12) v1(44.7,85.47) v1(45.29,70.87) v1(45.29,67.06) v1(45.72,17.29) v1(45.85,24.05) v1(46.08,94.48) v1(47.5,24.56) v1(47.65,51.81) v1(48.9,35.48) v1(49.1,70.87) v1(49.1,67.06) v1(49.46,41.31) v1(49.89,98.29) v1(49.89,94.48) v1(49.89,90.67) v1(49.89,79.24) v1(50.04,7.8) v1(50.09,44.13) v1(50.75,28.27) v1(50.8,7.8) v1(51.46,51.81) v1(52.45,8.05) v1(52.91,70.87) v1(52.91,67.06) v1(53.7,98.29) v1(53.7,94.48) v1(53.7,86.86) v1(53.7,83.05) v1(53.7,79.24) v1(54.56,16.84) v1(54.99,39.67) v1(54.99,38.91) v1(55.27,48) v1(55.37,40.31) v1(55.5,38.28) v1(56.64,17.83) v1(56.72,70.87) v1(56.72,67.06) v1(56.82,26.52) v1(57.28,16.18) v1(57.28,1.57) v1(57.51,94.48) v1(57.51,86.86) v1(57.51,83.05) v1(57.51,79.24) v1(60.53,55.63) v1(61.32,98.29) v1(61.32,94.48) v1(61.32,75.43) v1(61.32,71.62) v1(61.32,67.81) v1(64.34,55.63) v1(64.34,48.01) v1(64.34,40.39) v1(64.34,36.58) v1(64.34,28.96) v1(64.34,25.15) v1(64.34,17.53) v1(64.34,13.72) v1(64.34,9.91) v1(65.13,94.48) v1(65.13,90.67) v1(65.13,86.86) v1(65.13,83.05) v1(65.13,79.24) v1(65.13,75.43) v1(65.13,71.62)
VCC3V3: length 14.5
  Top Layer w0.254: v1(34.91,65.42) 35.66,64.66 R37.1 ; U5.6 65.02,7.76 v1(65.02,6.78) ; U1.5 20.83,77.71 C16.2 C15.2 ; U42.5 33.51,72.34 33.75,72.59 34.59,72.59 34.83,72.34 35.53,72.34 C27.1 ; U42.8 31.75,72.25 C28.1
  Top Layer w0.508: v1(1.14,80.75) R6.1 ; v1(7.62,41.58) 7.24,41.58 6.91,41.25 U14.2
  Bottom Layer w0.254: v1(65.28,69.14) 65.26,69.12 FPC4.6
  vias: v1(13.21,4.5) v1(13.98,4.5) v1(23.88,77.27) v1(24.51,77.27) v1(25.15,77.27) v1(29.21,72.19) v1(29.34,66.85) v1(29.34,65.96) v1(32.13,11.61) v1(32.14,3.53) v1(32.89,88.19) v1(32.89,87.43) v1(33.66,88.19) v1(33.66,87.43) v1(33.78,3.48) v1(34.16,11.61) v1(37.08,72.19) v1(48.01,7.67) v1(58.29,64.06) v1(61.85,86.67) v1(61.98,37.26) v1(61.98,36.5) v1(65.33,60.26)
VCC5V: length 1.8
  Top Layer w0.254: U1.1 16.35,77.97 C14.2
  vias: v1(12.19,78.28) v1(12.19,77.49) v1(12.18,76.76) v1(12.96,78.28) v1(12.96,77.49) v1(12.95,76.76) v1(13.73,78.28) v1(13.73,77.49) v1(13.72,76.76) v1(42.93,77.9) v1(42.93,77.11) v1(43.7,77.9) v1(43.7,77.11)
VCCBAT: length 35.5
  Top Layer w0.254: 3.78,68.69 4.55,68.69 4.55,67.53 C6.2
  Top Layer w0.508: Q1.2 0.55,63.26 0.55,73.25 1.4,74.09 7.24,74.09 9.53,76.38 9.53,82.22 10.15,82.85 R7.1
  vias: v1(12.94,56.19) v1(12.94,55.5) v1(12.94,54.79) v1(13.72,56.19) v1(13.72,55.5) v1(13.72,54.79) v1(14.49,56.19) v1(14.49,55.5) v1(14.49,54.79) v1(14.86,40.69) v1(14.86,39.8) v1(15.05,29.64) v1(15.05,28.88) v1(15.11,16.43) v1(15.11,15.54) v1(15.62,40.69) v1(15.62,39.8) v1(15.88,29.64) v1(15.88,28.88) v1(15.88,16.43) v1(15.88,15.54) v1(49.66,46.41) v1(49.66,45.64) v1(50.04,16.43) v1(50.04,15.54) v1(50.44,45.64) v1(50.46,46.41) v1(50.8,16.43) v1(50.8,15.54) v1(51.18,39.29) v1(51.44,40.18) v1(51.44,38.41) v1(52.14,28.75) v1(52.14,27.99) v1(52.96,28.75) v1(52.96,27.99)
B5: length 27.2
  Top Layer w0.254: 29.24,83.58 29.24,84.64 29.74,85.14 35.31,85.14 36.07,85.9 36.07,92.25 36.61,92.79 39.09,92.79 40.64,91.24 40.64,89.28 42.13,87.79 H2.6
B26: length 31.4
  Top Layer w0.254: v1(61.98,80.57) 61.98,79.56 R14.2 61.98,77.53 R15.1 ; v1(37.97,84.89) 38.04,84.82 38.04,83.58
  Bottom Layer w0.254: v1(37.97,84.89) 59.69,84.89 61.98,82.6 v1(61.98,80.57)
B27: length 30.4
  Top Layer w0.254: C17.2 15.39,82.38 v1(15.88,82.38) ; 14.37,81.36 14.35,81.34 R8.1 R7.2 ; v1(22.07,82.44) 22.07,82.18 22.92,81.33 38.2,81.33 38.84,80.7 38.84,79.58
  Bottom Layer w0.254: v1(15.88,82.38) 15.94,82.44 v1(22.07,82.44)
B28: length 8.4
  Top Layer w0.254: 38.84,83.58 38.84,90.02 H2.3
B29: length 34.4
  Top Layer w0.254: 39.64,79.58 39.64,81.34 40.26,81.97 47.62,81.97 48.31,82.65 48.31,88.26 47.41,89.17 42.2,89.17 41.28,90.09 41.28,92.38 41.91,93.02 46.74,93.02 47.62,92.13 H2.7
B30: length 4.4
  Top Layer w0.254: 39.64,83.58 39.75,83.7 39.75,87.53 H2.4
B31: length 24.4
  Top Layer w0.254: 40.44,79.58 40.44,80.87 40.89,81.33 48.13,81.33 49.02,82.22 49.02,88.57 47.62,89.97 43.96,89.97 42.54,91.39
C0: length 71
  Top Layer w0.254: v1(16.64,8.56) 16.64,6.38 U13.4 ; U3.B21 35.69,59.15 v1(35.69,57.71)
  Bottom Layer w0.254: v1(35.69,57.71) 35.69,53.64 35.05,53.01 18.03,53.01 16.46,51.44 16.46,8.74 v1(16.64,8.56)
C1: length 67.9
  Top Layer w0.254: U13.3 15,7.21 v1(15.57,7.78) ; U3.B22 35.64,52.7 35.69,52.65
  Bottom Layer w0.254: v1(15.57,7.78) 16.69,7.78 17.4,8.5 17.4,50.98 18.72,52.3 35.33,52.3 35.69,52.65
  vias: v1(35.69,52.68)
C2: length 49.4
  Top Layer w0.254: U14.3 6.78,39.75 8,38.53 ; U3.B23 34.84,57.75 v1(34.8,57.71)
  Bottom Layer w0.254: v1(8,38.66) 8.25,38.91 8.25,56.69 9.27,57.71 v1(34.8,57.71)
C3: length 45.9
  Top Layer w0.254: U14.4 7.27,38.25 v1(8,37.52) ; U3.B24 34.87,55.17 v1(34.87,53.77)
  Bottom Layer w0.254: v1(8,37.52) 8,37.83 8.89,38.72 8.89,52.46 10.19,53.77 v1(34.87,53.77)
C5: length 88.9
  Top Layer w0.254: v1(6.95,80.66) 7.28,80.99 7.28,82.31 6.6,82.98 6.6,89.08 7.49,89.97 19.69,89.97 20.45,89.2 CN4.4 ; U3.B26 34.04,52.63 34.47,52.2 35.34,52.2 35.44,52.09 35.93,52.09 36.03,52.2 v1(37.47,52.2)
  Bottom Layer w0.254: v1(37.47,52.2) 37.47,58.42 36.8,59.08 8.28,59.08 6.95,60.42 v1(6.95,80.66)
C6: length 75.4
  Top Layer w0.254: U3.B27 33.24,64.14 v1(33.11,64.26) ; v1(22.86,90.47) 22.86,92.37 CN4.1
  Bottom Layer w0.254: v1(33.11,64.26) 28.27,64.26 27.18,63.17 22.1,63.17 19.43,60.5 9.53,60.5 9.07,60.96 9.07,80.89 9.89,81.71 22.17,81.71 22.91,82.45 22.91,90.43 v1(22.86,90.47)
C7: length 95.9
  Top Layer w0.254: CN4.3 20.45,91.62 19.3,90.47 4.7,90.47 4.15,89.92 4.15,87.41 4.51,87.05 5.08,87.05 5.59,86.54 5.59,82.86 6.69,81.75 v1(6.69,81.67) ; U3.B28 33.24,52.29 33.96,51.56 v1(38.23,51.56)
  Bottom Layer w0.254: v1(6.69,81.67) 7.53,81.67 8.13,81.08 8.13,60.63 9.02,59.74 37.21,59.74 38.15,58.8 38.15,51.64 v1(38.23,51.56)
C8: length 92
  Top Layer w0.254: v1(40.44,11.92) 41.4,10.96 R25.2 ; U3.B29 32.44,57.53 33.15,56.82 v1(38.99,56.82)
  Bottom Layer w0.254: v1(38.99,56.82) 38.99,50.72 38.48,50.22 21.21,50.22 20.5,49.51 20.5,12.95 21.21,12.24 40.12,12.24 v1(40.44,11.92)
C9: length 61
  Top Layer w0.254: U3.B30 32.44,54.36 32.38,54.31 v1(32.38,51.71) ; R24.2 24.76,10.72 v1(23.62,10.72)
  Bottom Layer w0.254: v1(32.38,51.71) 31.7,51.03 19.99,51.03 19.33,50.37 19.33,12.72 21.34,10.72 v1(23.62,10.72)
C10: length 48.5
  Top Layer w0.254: U3.B31 v1(31.64,60.86) 32,61.22 R40.2 32,65.88 R39.2
  Bottom Layer w0.254: FPC4.4 64.77,68.12 65.57,67.32 65.57,62.19 64.23,60.86 v1(31.64,60.86)
C11: length 71.7
  Top Layer w0.254: U3.B32 31.64,57.19 31,57.82 23.28,57.82 22.56,58.54 v1(22.56,60.43) ; U42.12 32.5,69.13 32,68.63 30.73,68.63 30.35,68.25 R41.2 29.2,67.61 28.7,67.11 v1(28.7,62.3)
  Bottom Layer w0.254: FPC4.3 63.63,67.62 63.25,67.23 63.25,63.68 62.61,63.04 29.44,63.04 v1(28.7,62.3) 28.6,62.3 27.81,61.52 22.99,61.52 22.56,61.09 v1(22.56,60.43)
C12: length 52.1
  Top Layer w0.254: U3.B33 30.84,61.42 v1(30.73,61.52) 30.99,61.77 30.99,62.15 31.3,62.46 31.3,66.41 31.81,66.92 33.25,66.92 R38.2 34.15,66.02 R37.2
  Bottom Layer w0.254: FPC4.2 64.63,67.12 64.9,66.85 64.9,62.66 63.75,61.52 v1(30.73,61.52)
C13: length 65.1
  Top Layer w0.254: v1(36.85,62.28) 36.85,65.19 R36.1 ; v1(23.45,60.94) 23.38,61.01 21.97,61.01 21.59,60.63 21.59,58.22 22.61,57.2 30.35,57.2 30.84,56.72 U3.B34
  Bottom Layer w0.254: FPC4.1 64.12,63.15 63.25,62.28 v1(36.85,62.28) 29.72,62.28 28.37,60.94 v1(23.45,60.94)
C14: length 104.9
  Top Layer w0.254: U3.B35 v1(30.04,60.88) ; R26.2 42.16,3.36 v1(42.16,8.05)
  Bottom Layer w0.254: v1(42.16,8.05) 42.16,11.61 40.26,13.51 22.1,13.51 21.84,13.77 21.84,49.07 22.22,49.45 38.8,49.45 39.57,50.23 39.57,59.16 38.46,60.27 31.39,60.27 30.78,60.88 v1(30.04,60.88)
C15: length 68.6
  Top Layer w0.254: U3.B36 30.1,55.14 v1(30.1,51.61) ; R27.2 24.74,2.84 v1(23.93,2.84)
  Bottom Layer w0.254: v1(30.1,51.61) 19.56,51.61 18.57,50.62 18.57,7.64 19.81,6.4 23.5,6.4 23.93,5.97 v1(23.93,2.84)
C21: length 64.7
  Top Layer w0.254: 50.16,87.79 50.16,81.71 47.5,79.05 v1(47.5,76) ; U3.B40 28.44,56.05 27.79,56.69 21.72,56.69 20.83,57.58 20.83,61.01 v1(20.89,61.07)
  Bottom Layer w0.254: 47.5,75.87 47.5,64.82 46.35,63.68 28.83,63.68 27.43,62.28 22.1,62.28 v1(20.89,61.07)
C28: length 64.4
  Top Layer w0.254: R28.1 48.72,32.71 v1(48.72,33.55) ; v1(39.62,34.35) 39.62,42.47 37.59,44.5 37.59,48.06 36.96,48.69 24.13,48.69 22.73,50.09 22.73,55.17 22.2,55.7 20.04,55.7 19.18,56.57 19.18,61.65 20.07,62.53 24.64,62.53 25.24,61.94 U3.B47
  Bottom Layer w0.254: v1(48.72,33.55) 40.8,33.55 40,34.35 v1(39.62,34.35)
C29: length 41.2
  Top Layer w0.254: R29.2 43.28,32.72 41.53,34.47 41.53,42.34 43.05,43.87 43.05,50.09 42.16,50.98 26.42,50.98 25.27,52.12 25.27,55.16 U3.B48
C30: length 71.9
  Top Layer w0.254: 43.79,18.36 42.39,18.36 41.66,19.1 41.66,28.88 41.21,29.33 39.74,29.33 38.62,30.45 38.62,32.3 40.26,33.94 40.26,42.72 38.62,44.36 38.62,49.06 37.97,49.71 24.51,49.71 23.5,50.72 23.5,55.42 22.73,56.19 20.7,56.19 19.94,56.95 19.94,61.14 20.7,61.9 23.75,61.9 24.44,61.21 24.44,59.2
C31: length 51.3
  Top Layer w0.254: U3.B50 24.44,51.31 25.4,50.34 41.15,50.34 42.28,49.21 42.28,44.11 40.83,42.66 40.83,33.83 42.54,32.11 42.54,23.29 42.93,22.91 43.58,22.91 R30.1
CR: length 56.9
  Top Layer w0.254: U1.3 17.47,75.81 18.07,76.42 18.07,80.53 v1(17.91,80.7) ; U6.4 10.67,76.54 v1(10.67,75.62) ; 40.44,83.58 40.39,83.64 v1(40.39,85.47) 41.07,86.16 46.61,86.16 47.24,85.53 R48.1 47.24,84.24 NOREF#2.1
  Bottom Layer w0.254: v1(40.39,85.47) 25.09,85.47 24.16,84.54 24.16,82.13 22.73,80.7 v1(17.91,80.7) 12.06,80.7 10.03,78.66 10.03,76.25 v1(10.67,75.62)
D0: length 21.4
  Top Layer w0.254: 24.44,79.58 22.32,79.58 21.34,80.57 21.34,84 20.83,84.51 14.73,84.51 13.97,85.27 13.97,87.94 13.59,88.32 CN2.4
D1: length 21.6
  Top Layer w0.254: CN2.3 7.73,88.68 8.44,89.39 14.03,89.39 14.59,88.84 14.59,85.79 15.24,85.14 22.88,85.14 24.44,83.58
D4: length 81.3
  Top Layer w0.254: v1(16.38,58.31) 16.38,73.71 17.78,75.11 25.53,75.11 26.03,75.62 26.03,79.58 ; R33.2 11.05,23.16 11.05,30.76 v1(11.43,31.14)
  Bottom Layer w0.254: v1(11.43,31.14) 11.36,31.07 11.36,32.51 10.67,33.2 7.75,33.2 6.73,34.21 6.73,56.69 8.38,58.34 16.35,58.34 v1(16.38,58.31)
D5: length 95
  Top Layer w0.254: 26.04,83.58 26.04,82.74 25.39,82.09 23.39,82.09 22.05,83.44 v1(22.05,83.53) ; R32.1 v1(7.49,16.09)
  Bottom Layer w0.254: v1(7.49,16.09) 7.49,19.35 10.67,22.53 10.67,31.67 10.03,32.31 6.86,32.31 5.97,33.2 5.97,82.35 7.37,83.74 21.83,83.74 v1(22.05,83.53)
D6: length 45.4
  Top Layer w0.254: R35.2 17.15,44.89 17.15,73.2 18.11,74.16 25.47,74.16 26.74,75.44 26.74,76.83 27.81,77.9 29.2,77.9 30.04,78.74 30.04,79.58
D7: length 48.3
  Top Layer w0.254: R34.1 22.07,45.55 21.34,46.28 18.41,46.28 18.03,46.66 18.03,72.69 18.8,73.46 25.65,73.46 27.51,75.31 27.51,76.71 28.07,77.27 29.36,77.27 30.56,78.47 30.56,79.31 30.84,79.58
D8: length 40.3
  Top Layer w0.254: R19.2 59.44,72.69 57.53,74.6 42.42,74.6 41.53,75.49 41.53,76.38 40.64,77.27 32.09,77.27 31.64,77.72 31.64,79.58
D9: length 44.2
  Top Layer w0.254: 32.44,79.58 32.44,78.11 32.77,77.78 41.66,77.78 42.09,77.34 42.09,75.92 42.7,75.31 58.22,75.31 60.2,73.33 60.2,66.6 60.83,65.96 64.01,65.96 64.26,65.71 R18.2
D13: length 35.2
  Top Layer w0.254: v1(58.74,49.39) 58.74,57.52 57.18,59.08 43.76,59.08 U3.B1 ; U16.4 60.26,39.67 v1(58.8,39.67)
  Bottom Layer w0.254: v1(58.74,49.39) 58.8,49.33 v1(58.8,39.67)
D14: length 34.7
  Top Layer w0.254: U3.B2 56.23,55.2 56.96,54.47 56.96,49 58.04,47.93 60.96,47.93 62.1,46.79 62.1,39.47 61.6,38.97 61.06,38.97 U16.3
D15: length 84.2
  Top Layer w0.254: U15.4 51.04,4.62 51.29,4.37 59.82,4.37 60.71,5.26 60.71,23.67 62.74,25.71 62.74,47.3 61.34,48.69 58.36,48.69 57.78,49.26 57.78,56.44 56.81,57.42 43.34,57.42 42.84,57.93 U3.B3
D16: length 73.8
  Top Layer w0.254: v1(57.91,47.09) 56.13,48.87 56.13,52.63 55.25,53.52 43.56,53.52 42.84,54.24 U3.B4 ; U15.3 49.66,5.9 v1(49.66,4.24)
  Bottom Layer w0.254: v1(49.66,4.24) 56.9,4.24 58.22,5.56 58.22,46.79 v1(57.91,47.09)
L_B_A: length 8.4
  Top Layer w0.254: 15.99,18.86 16,18.85 16,18.34 17.15,17.2 17.15,16.56 17.93,15.77 20.73,15.77 21.07,15.43 Q30.2
L_B_B: length 9.4
  Top Layer w0.254: U7.18 13.3,15.89 12.83,15.42 11.56,15.42 10.83,14.69 10.83,13.75 9.92,12.85 Q34.2
L_B_EN: length 6.4
  Top Layer w0.254: U7.14 11.86,21.56 11.25,20.95 11.25,20.26 10.4,19.41 R12.2 10.36,19.09 R33.1
L_B_PH: length 7.3
  Top Layer w0.254: U7.15 13.24,21.01 12.32,21.01 11.68,20.37 11.68,19.48 11.25,19.05 11.25,18.02 R43.2 8.61,17.57 R32.2
L_F_A: length 6.7
  Top Layer w0.254: 17.97,38.21 15.2,38.21 14.48,37.48 14.48,35.05 Q33.2
L_F_B: length 12.3
  Top Layer w0.254: 18.67,40.9 17.19,40.9 16,42.09 16,46.28 15.24,47.04 12.71,47.04 11.76,46.09
L_F_EN: length 7.8
  Top Layer w0.254: 20.67,40.9 20.69,40.92 R5.2 21.34,43.68 21.34,45.18 20.87,45.64 19.5,45.64 18.85,44.99 R35.1
L_F_PH: length 5.4
  Top Layer w0.254: R34.2 20.56,44.47 19.12,43.03 R11.2 18.76,42.7 20.17,41.29 20.17,40.9
NSLEEP: length 141
  Top Layer w0.254: v1(22.5,27.92) 14.53,27.92 13.3,26.68 U7.13 ; U32.13 47.75,22.14 v1(46.74,22.14) ; 21.17,40.9 21.17,41.28 21.67,41.79 v1(22.48,41.79) ; 64.64,5.51 62.48,5.51 61.72,6.27 R93.1 ; 64.64,5.51 64.52,5.38 64.52,4.42 63.75,3.66 46.9,3.66 v1(46.82,3.73) ; 64.64,5.51 U5.5 ; U31.13 44.83,37.08 44.83,31.55 45.59,30.78 v1(46.86,30.78)
  Bottom Layer w0.254: v1(22.48,41.79) 22.5,41.76 v1(22.5,27.92) 22.61,27.82 22.61,14.66 22.86,14.4 40.51,14.4 42.75,12.17 42.75,4.29 43.31,3.73 v1(46.82,3.73) 46.74,3.82 v1(46.74,22.14) 46.74,30.66 v1(46.86,30.78)
R_B_A: length 8.9
  Top Layer w0.254: Q28.2 55.99,14.93 55.3,15.62 52.87,15.62 52.2,16.29 52.2,17.07 51.56,17.7 50.78,17.7 50.53,17.96 U32.23
R_B_B: length 11.7
  Top Layer w0.254: U32.18 47.84,16.14 47.24,15.54 44.32,15.54 43.51,14.73 43.51,12.75 44.16,12.1 Q27.2
R_B_EN: length 4.8
  Top Layer w0.254: R31.1 44.07,19.87 R46.2 45.94,21.56 U32.14
R_B_PH: length 8.8
  Top Layer w0.254: R30.2 43.37,21.58 42.75,20.95 42.75,19.41 42.97,19.19 45.05,19.19 R47.2 46.92,21.06 U32.15
R_F_A: length 7.6
  Top Layer w0.254: Q22.2 50.16,43.1 50.16,40.31 49.65,39.79 U31.23
R_F_B: length 11.2
  Top Layer w0.254: U31.18 49.56,37.1 50.42,36.25 50.42,32.94 50.93,32.44 53.26,32.44 Q24.2
R_F_EN: length 5.4
  Top Layer w0.254: U31.14 45.35,34.69 R44.2 47.36,32.68 47.36,32.56
R_F_PH: length 9.7
  Top Layer w0.254: R29.1 46.54,31.72 47.83,31.72 48.13,32.02 48.13,34.09 47.76,34.46 R45.2 46.87,34.46 45.85,35.48 U31.15
$2N1832: length 33.6
  Top Layer w0.508: CN10.1 8.25,29.22 7.33,29.22 5.84,27.74 5.84,20.37 4.19,18.72 D1.1 4.19,7.39 4.8,6.78 8.38,6.78 8.89,6.27 8.89,3.99 8.04,3.14 U41.3
  vias: v1(3.43,50.85) v1(3.43,49.96) v1(3.43,49.07) v1(4.31,50.85) v1(4.31,49.96) v1(4.31,49.07) v1(5.19,50.85) v1(5.19,49.96) v1(5.19,49.07)
$2N1836: length 2.2
  Top Layer w0.254: C7.1 2.37,70.94 U12.8
$2N1839: length 8.1
  Top Layer w0.254: U12.7 4.57,70.96 4.57,72.69 5.21,73.33 8.51,73.33 9.14,73.97 R2.2
$2N1840: length 1.3
  Top Layer w0.254: R9.1 U4.1
$2N1843: length 1.6
  Top Layer w0.254: U6.3 7.91,76.38 R10.2
$2N1853: length 1.3
  Top Layer w0.254: R6.2 U2.1
$2N1854: length 52.8
  Top Layer w0.508: 7.5,5.64 4.01,5.64 2.92,6.73 2.92,19.61 4.56,21.24 4.56,25.47 3.47,26.56 3.47,45.86 2.2,47.13 2.2,52.89
$2N3072: length 3.4
  Top Layer w0.254: U12.6 5.2,72.07 R3.1 5.33,72.18 R4.1
$3N2806: length 8.1
  Top Layer w0.254: R13.2 63.44,89.52 62.48,90.47 BUZZER1.1
$3N2807: length 13.5
  Top Layer w0.254: Q2.3 62.74,83.96 62.74,88.7 62.23,89.2 59.06,89.2 57.78,90.47 BUZZER1.2
$3N2808: length 2.9
  Top Layer w0.254: Q2.1 63.49,79.94 R14.1
$3N2832: length 5.4
  Top Layer w0.254: SW3.2 62.87,59.86 R16.1 62.76,63.21 R18.1
$3N2833: length 5.3
  Top Layer w0.254: R19.1 R17.1 60.95,59.73 SW3.1
$3N2836: length 9
  Top Layer w0.254: R20.1 31.52,9.07 U8.1 30.28,9.61 30.28,9.12 29.52,8.36 25.61,8.36 R24.1
$3N2837: length 8.9
  Top Layer w0.254: R21.1 34.93,8.31 39.12,8.31 40.07,9.26 U9.1 40.7,9.33 R25.1
$3N2838: length 9.2
  Top Layer w0.254: R26.1 40.73,1.08 U10.1 39.86,1.3 38.99,0.43 38.26,0.43 38.26,0.43 35.02,0.43 34.4,1.04 R22.1
$3N2839: length 9
  Top Layer w0.254: R27.1 25.65,0.43 29.97,0.43 30.67,1.13 30.67,1.51 ; 30.67,1.51 31.11,1.08 R23.1 ; 30.67,1.51 U11.1
$3N2930: length 4.7
  Top Layer w0.254: R36.2 35.99,67.66 35.99,68.58 35.81,68.76 34.42,68.76 34.17,69 U42.1
$3N2936: length 3.2
  Top Layer w0.254: U42.13 33,68.39 R39.1
$3N2937: length 3.1
  Top Layer w0.254: U42.14 33.5,69.1 34.08,68.52 R38.1
$4N1698: length 3.8
  Top Layer w0.254: C68.2 22.41,36.16 21.64,36.16 21.17,36.63 U30.6 21.17,37.02 U30.7
$4N1712: length 11.3
  Top Layer w0.254: 17.18,19.56 21.06,19.56 C82.2 23.73,20.37 C85.1 D3.2 23.58,22.33 C73.2
$4N1713: length 7.7
  Top Layer w0.254: D2.2 18.55,33.6 C70.2 17.22,33.95 C84.1 C83.2 17.54,35.88 U30.1
$4N1721: length 1.8
  Top Layer w0.254: LED1.A 61.72,14.91 R93.2
$4N1733: length 2
  Top Layer w0.254: C71.2 15.99,24.16 15.99,22.76
$4N1735: length 8.7
  Top Layer w0.254: U7.17 12.57,20.06 12.32,19.81 12.32,17.47 11.66,16.81 10.03,16.81 9.78,16.56 9.78,14.37 Q34.1
$4N1736: length 12.4
  Top Layer w0.254: Q35.1 11.78,8.43 v1(12.82,8.43) ; v1(13.99,15.93) 13.99,18.86
  Bottom Layer w0.254: v1(13.99,15.93) 13.99,9.09 13.34,8.43 12.83,8.43 v1(12.82,8.43)
$4N1737: length 12.2
  Top Layer w0.254: Q31.1 19.07,11.25 20.07,12.24 20.07,15.3 20,15.37 17.32,15.37 16.64,16.05 16.64,16.94 15.49,18.09 15.49,18.86
$4N1738: length 10.2
  Top Layer w0.254: 16.49,18.86 17.78,17.57 17.78,16.94 18.4,16.32 v1(21.16,16.32) ; Q30.1 21.07,12.99 v1(21.21,13.13)
  Bottom Layer w0.254: v1(21.16,16.32) 21.21,16.27 v1(21.21,13.13)
$4N1743: length 4.5
  Top Layer w0.254: C73.1 19.3,21.52 19.3,20.53 18.83,20.06 17.18,20.06
$4N1744: length 7.5
  Top Layer w0.254: C65.1 21.34,24.57 21.34,23.71 20.7,23.07 19.05,23.07 18.8,22.82 18.8,20.91 18.44,20.56 17.18,20.56
$4N1745: length 5.6
  Top Layer w0.254: C65.2 19.99,24.01 19.56,23.58 18.73,23.58 18.39,23.24 18.39,21.52 17.93,21.06 17.18,21.06
$4N1746: length 7.2
  Top Layer w0.254: 17.18,22.06 17.18,22.07 U7.7 16.49,23.53 17.02,24.05 18.41,24.05 18.87,24.51 18.87,25.14 19.18,25.45 19.56,25.45 19.99,25.88 C72.2
$4N1749: length 13.2
  Top Layer w0.254: v1(14.65,47.75) 15.67,47.75 16.58,46.85 16.58,42.28 17.09,41.76 18.99,41.76 19.17,41.58 19.17,40.9 ; Q36.1 v1(14.73,46.09)
  Bottom Layer w0.254: v1(14.65,47.75) 14.73,47.67 v1(14.73,46.09)
$4N1750: length 13.9
  Top Layer w0.254: Q37.1 7.97,44.34 8.64,45.01 14.6,45.01 15.49,44.12 15.49,41.83 17.12,40.21 17.97,40.21
$4N1751: length 10.7
  Top Layer w0.254: Q32.1 10.38,35.61 13.46,35.61 13.97,36.13 13.97,38.2 14.48,38.71 17.97,38.71
$4N1752: length 10.5
  Top Layer w0.254: Q33.1 v1(11.05,34.7) ; v1(15.21,37.25) 15.67,37.71 17.97,37.71
  Bottom Layer w0.254: v1(15.21,37.25) 15.21,35.33 14.58,34.7 v1(11.05,34.7)
$4N1757: length 1.8
  Top Layer w0.254: U30.2 19.17,35.62 C70.1
$4N1758: length 4.4
  Top Layer w0.254: C64.1 21.01,33.91 20.25,33.91 19.67,34.49 U30.3
$4N1759: length 2.7
  Top Layer w0.254: U30.4 20.19,36.99 20.19,35.48 20.37,35.3 21.01,35.3 C64.2
$4N1761: length 1.9
  Top Layer w0.254: C69.2 23.66,38.21 U30.8
$4N1772: length 7.5
  Top Layer w0.254: U32.6 51.72,22.06 U32.7 51.03,25.17 52.38,26.52 C78.2
$4N1775: length 2.5
  Top Layer w0.254: U31.6 44.16,40.29 U31.7 42.88,40.29 C75.2
$4N1787: length 13
  Top Layer w0.254: U32.1 55.34,19.56 C80.2 55.94,20.16 C79.2 56.15,22.36 D6.2 58.42,22.21 58.42,19.24 C87.1
$4N1788: length 9.1
  Top Layer w0.254: U31.1 47.68,41.32 C81.2 C86.1 ; D5.2 47.68,48.05 C86.1 ; C86.1 45.87,44.53 C74.2
$4N1801: length 2.1
  Top Layer w0.254: U32.8 50.53,24.05 C77.2
$4N1803: length 10.7
  Top Layer w0.254: Q27.1 v1(44.59,13) ; v1(44.59,16.26) 46.43,16.26 47.12,16.94 47.12,19.73 47.44,20.06 U32.17
  Bottom Layer w0.254: v1(44.59,16.26) v1(44.59,13)
$4N1804: length 13.4
  Top Layer w0.254: U32.19 48.53,15.43 48.01,14.91 45.82,14.91 45.57,14.66 45.57,9.21 Q26.1
$4N1805: length 13
  Top Layer w0.254: Q29.1 54.89,11.04 54.89,14.72 54.76,14.86 52.49,14.86 51.56,15.79 51.56,16.81 51.31,17.07 50.28,17.07 50.03,17.32 U32.22
$4N1806: length 12.4
  Top Layer w0.254: v1(56.01,11.35) 56.01,12.16 Q28.1 ; U32.24 51.21,18.68 v1(54.58,18.68)
  Bottom Layer w0.254: v1(54.58,18.68) 54.58,18.5 56.06,17.02 56.06,11.41 v1(56.01,11.35)
$4N1811: length 4.7
  Top Layer w0.254: U32.2 54.04,20.06 54.61,20.62 54.61,22.08 54.54,22.15
$4N1812: length 7.6
  Top Layer w0.254: U32.3 53.27,20.56 53.85,21.13 53.85,23.04 54.28,23.47 55.68,23.47 56.06,23.85 56.06,24.48 C67.1
$4N1813: length 5.7
  Top Layer w0.254: U32.4 52.76,21.06 53.21,21.51 53.21,23.93 53.9,24.62 C67.2
$4N1816: length 11.6
  Top Layer w0.254: v1(51.23,31.79) 50.43,31.79 49.91,32.31 49.91,35.61 49.15,36.37 47.12,36.37 46.86,36.63 46.86,37.09 U31.17 ; Q24.1 v1(51.18,33.43)
  Bottom Layer w0.254: v1(51.18,33.43) 51.18,31.84 v1(51.23,31.79)
$4N1817: length 13.3
  Top Layer w0.254: U31.19 48.07,37.77 50.67,37.77 51.23,37.21 51.23,34.67 51.49,34.42 55.67,34.42 55.68,34.41 56.61,34.41 56.62,34.42 57.15,34.42 Q25.1
$4N1818: length 12.2
  Top Layer w0.254: U31.22 48.12,39.36 50.42,39.36 50.67,39.62 50.67,42.72 51.69,43.74 55.55,43.74 56.09,43.2 Q23.1
$4N1819: length 11.6
  Top Layer w0.254: Q22.1 54.61,44.83 54.74,44.7 ; U31.24 48.27,40.51 v1(48.27,41.56)
  Bottom Layer w0.254: v1(54.74,44.75) 49.02,44.75 48.27,44 v1(48.27,41.56)
$4N1824: length 2.6
  Top Layer w0.254: C74.1 46.85,42.15 U31.2
$4N1825: length 4.9
  Top Layer w0.254: C66.1 45.12,43.63 45.12,42.47 45.37,42.22 45.85,42.22 46.35,41.71 46.35,40.99 U31.3
$4N1826: length 3.6
  Top Layer w0.254: C66.2 44.14,43.21 44.14,42.06 44.4,41.81 45.42,41.81 45.85,41.38 U31.4
$4N1828: length 1.9
  Top Layer w0.254: U31.8 44.09,39.73 43.68,39.73 C76.2

## Copper pours and planes (outline as drawn; the poured copper is in the pictures)
GND on Top Layer: -7.24,116 77.22,116 77.22,-16.84 -7.24,-16.84
GND on Top Layer: 14.92,36.62 16.46,36.62 16.46,34.3 14.92,34.3
GND on Bottom Layer: -1.4,103.17 68.96,103.17 68.96,-5.92 -1.4,-5.92
GND on GND: -1.52,104.32 67.82,104.32 67.82,-2.74 -1.52,-2.74
VCC3V3 on Top Layer: 31.54,11.92 34.56,11.92 34.56,10.03 31.54,10.03
VCC3V3 on Top Layer: 32.48,88.95 35.69,88.95 35.69,86.67 32.48,86.67
VCC3V3 on Top Layer: 28.83,72.69 32.2,72.69 32.2,71.81 28.83,71.81
VCC3V3 on Top Layer: 28.95,67.35 31.11,67.35 31.11,63.04 28.95,63.04
VCC3V3 on Top Layer: 31.29,4.39 34.54,4.39 34.54,2.08 31.29,2.08
VCC3V3 on Top Layer: 63.85,63.54 65.79,63.54 65.79,59.11 63.85,59.11
VCC3V3 on Top Layer: 33.4,73.08 37.48,73.08 37.48,71.81 33.4,71.81
VCC3V3 on Top Layer: 18.41,79.3 26.26,79.3 26.26,76.89 18.41,76.89
VCC3V3 on Top Layer: 57.53,64.31 60.2,64.31 60.2,62.46 57.53,62.46
VCC3V3 on Top Layer: 59.06,37.52 62.23,37.52 62.23,36.12 59.06,36.12
VCC3V3 on Top Layer: 34.53,65.66 36.29,65.66 36.29,63.91 34.53,63.91
VCC3V3 on Top Layer: 12.83,7.67 14.35,7.67 14.35,3.99 12.83,3.99
VCC3V3 on Top Layer: 61.47,87.05 62.46,87.05 62.46,84.85 61.47,84.85
VCC3V3 on Top Layer: 47.37,8.05 48.6,8.05 48.6,4.74 47.37,4.74
VCC3V3 on POWER: -5.08,107.37 70.49,107.37 70.49,-9.22 -5.08,-9.22
VCC5V on Top Layer: 42.42,80.82 47.24,80.82 47.24,76.5 42.42,76.5
VCC5V on Top Layer: 11.68,74.6 11.68,77.64 10.39,77.64 10.39,78.97 17.49,78.97 17.49,77.38 14.1,77.38 14.1,68.22 5.53,68.22 5.53,71.39 12.06,71.39 12.06,73.2 11.52,73.2 11.52,74.6
VCC5V on Bottom Layer: 10.54,80.44 44.2,80.44 44.2,76.5 10.54,76.5
VCC5V_EXT on Top Layer: 5.78,77.9 5.78,79.17 0.26,79.17 0.26,93.65 16,93.65 16,90.6 5.72,90.6 5.72,80.5 8.89,80.5 8.89,77.9
VCCBAT on Top Layer: 11.43,44.88 15.89,44.88 15.89,35.93 11.43,35.93
VCCBAT on Top Layer: 58.95,25.11 57.66,25.11 57.66,27.61 51.69,27.61 51.69,29.13 58.95,29.13
VCCBAT on Top Layer: 49.27,48.88 51.44,48.88 51.44,45.39 49.27,45.39
VCCBAT on Top Layer: 14.73,30.66 19.18,30.66 19.17,33.25 22.35,33.25 22.35,30.02 22.36,30.01 24.51,30.01 24.51,25.2 23.13,25.2 23.13,28.5 14.73,28.5
VCCBAT on Top Layer: 51.18,34.72 51.18,37.77 50.93,37.77 50.93,43.48 54.48,43.48 54.48,34.72
VCCBAT on Top Layer: 51.18,16.75 51.18,14.53 54.61,14.53 54.61,12.12 45.97,12.12 45.97,14.53 49.65,14.53 49.65,16.75
VCCBAT on Top Layer: 4.75,69.02 4.75,62.92 10.53,62.92 10.53,61.52 16.89,61.52 16.89,53.27 10.54,53.26 10.54,54.66 -0.13,54.66 -0.13,68.12 3.25,68.12 3.25,69.02
VCCBAT on Top Layer: 14.6,16.94 14.62,16.95 16.27,16.95 16.27,15.16 19.76,15.15 19.76,12.19 11.3,12.19 11.3,15.16 14.6,15.16
VCCBAT on POWER: 38.02,46.07 41.19,41.86 49.25,41.86 49.25,46.95 54.36,46.95 54.36,15.16 49.25,15.16 49.25,36.12 41.18,36.12 38.01,31.92 33,30.32 27.99,31.92 24.82,36.12 18.16,36.12 18.16,14.91 12.45,14.91 12.45,56.69 18.16,56.69 18.16,41.86 24.81,41.86 27.98,46.07 33,47.68
L_B_A on Top Layer: 23.45,5.15 18.89,5.15 18.89,7.67 20.43,7.67 20.43,11.48 22.11,11.48 22.11,13.6 20.32,13.6 20.32,14.67 23.45,14.67
L_B_B on Top Layer: 8.71,13.66 10.61,13.66 10.61,7.73 12.83,7.73 12.83,5 8.71,5
L_F_A on Top Layer: 14.62,35.35 14.62,31.25 4.19,31.25 4.19,35.86 7.11,35.86 7.11,34.74 10.36,34.74 10.36,33.67 12.88,33.67 12.89,35.35
L_F_B on Top Layer: 12.41,46.87 12.41,45.11 7.23,45.11 7.24,42.09 4.39,42.09 4.39,46.87
R_B_A on Top Layer: 58.42,9.07 57.2,9.07 57.2,4.75 53.34,4.75 53.34,7.29 55.25,7.29 55.25,10.87 56.97,10.87 56.97,12.62 55.27,12.62 55.27,14.78 58.42,14.78
R_B_B on Top Layer: 45.24,12.5 45.24,7.16 47.04,7.16 47.04,4.72 43.05,4.72 43.05,12.5
R_F_A on Top Layer: 51.18,47.04 61.59,47.02 61.59,42.05 58.76,42.05 58.76,43.68 56.26,43.68 56.26,45.35 52.97,45.35 52.97,43.97 51.17,43.97 51.18,43.99
R_F_B on Top Layer: 53.72,34.21 58.85,34.21 58.85,35.82 62.23,35.82 62.23,32.69 53.72,32.69
$2N1832 on Top Layer: 2.54,54.28 7.49,54.28 7.49,48.69 2.54,48.69
$2N1832 on Bottom Layer: 10.45,27.4 2.57,27.4 2.57,51.81 5.72,51.81 5.72,31.67 10.45,31.67
$2N1855 on Top Layer: 4.95,14.15 8.25,14.15 8.25,7.54 4.95,7.54

Small or netless copper shapes (teardrops, artwork), in the pictures only: 4 on Top Layer

## Text on the board
Bottom Silkscreen Layer: IMU
Top Layer: 同济大学 / TU-Smart / 闪影队 / 20260501
Top Solder Mask Layer: 同济大学 / TU-Smart / 闪影队 / 20260501
Top Silkscreen Layer: ON | OFF | VCC | GND | D1 | D0 | NC | C7 | C5 | C6 | C2 | C3 | C1 | C0 | D16 | D15 | B28 | B30 | B31 | B5 | B29 | C21 | D13 | D14 | 3V3 | 5V | D8 | D9 | C9 | C15 | C14 | C8 | 电压测量 / B27 | openart | 左前 | 无 / 线 / 串 / 口 | 左后 | 右后 | 屏幕 | 右前 | 蜂鸣器 / B26 | 电源 | 电机
